# EAGLE schematic Arduino_Rotary_Encoder_LCD (EAGLE 7.6.0)
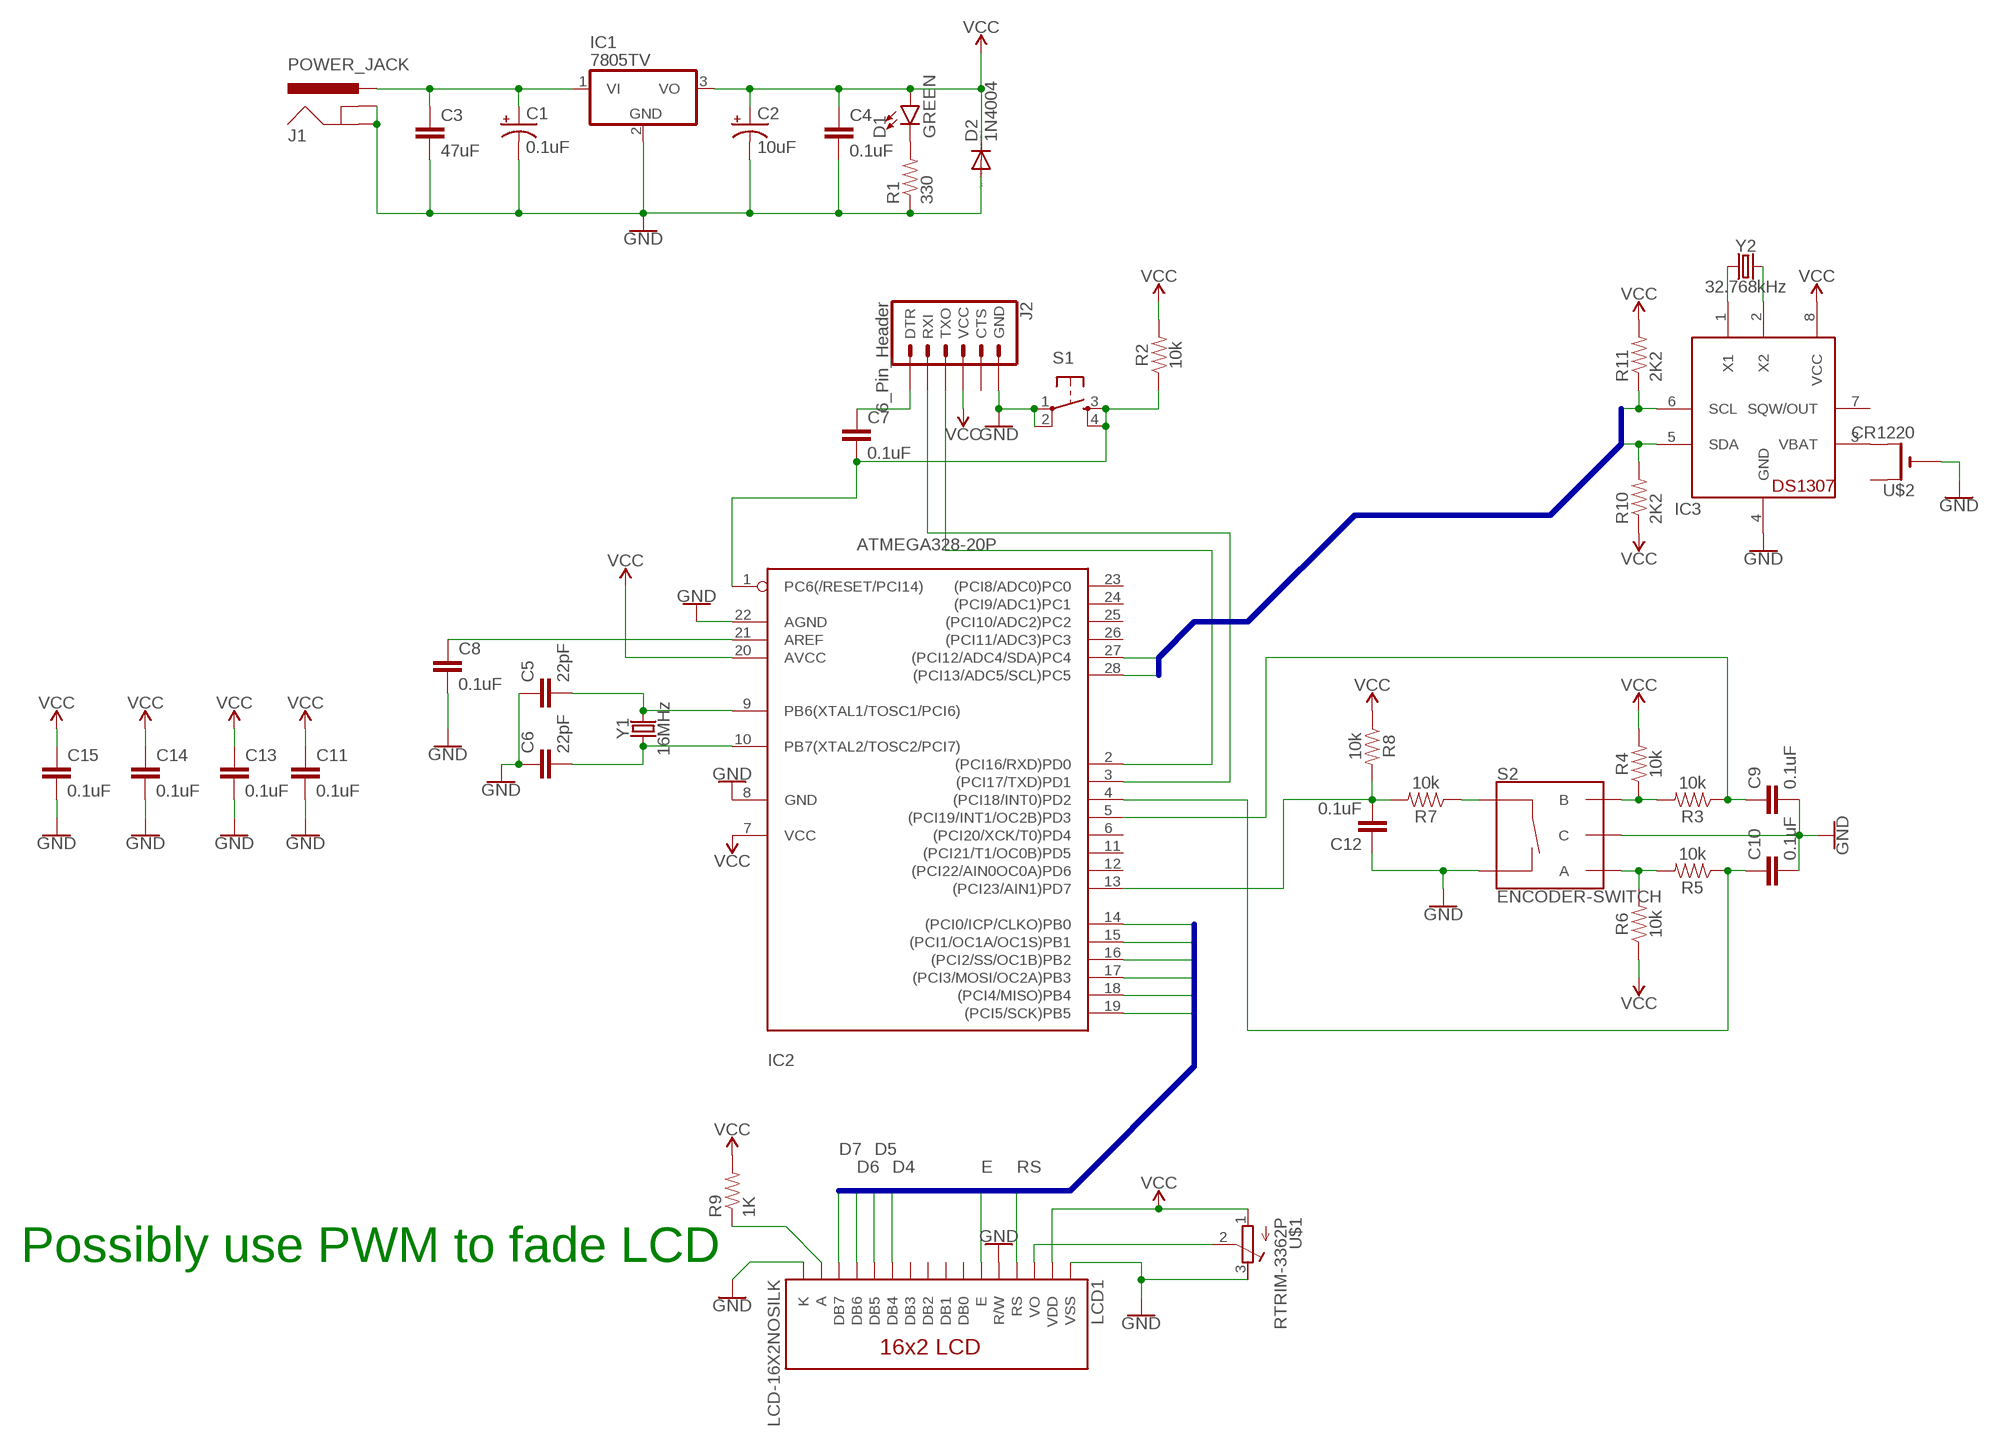
[diagram p0: schematic, sheet 1]

## Parts
C1  0.1uF  CAP_POLPTH2  [CPOL-RADIAL-10UF-25V]
C2  10uF  CAP_POLPTH2  [CPOL-RADIAL-10UF-25V]
C3  47uF  CAPPTH  [CAP-PTH-SMALL]
C4  0.1uF  CAPPTH  [CAP-PTH-SMALL]
C5  22pF  22PF-PTH-2.54MM-200V-5%  [CAP-PTH-2.54]
C6  22pF  22PF-PTH-2.54MM-200V-5%  [CAP-PTH-2.54]
C7  0.1uF  0.1UF-KIT-EZ-50V-20%  [CAP-PTH-SMALL-KIT]
C8  0.1uF  0.1UF-KIT-EZ-50V-20%  [CAP-PTH-SMALL-KIT]
C9  0.1uF  0.1UF-KIT-EZ-50V-20%  [CAP-PTH-SMALL-KIT]
C10  0.1uF  0.1UF-KIT-EZ-50V-20%  [CAP-PTH-SMALL-KIT]
C11  0.1uF  0.1UF-KIT-EZ-50V-20%  [CAP-PTH-SMALL-KIT]
C12  0.1uF  0.1UF-KIT-EZ-50V-20%  [CAP-PTH-SMALL-KIT]
C13  0.1uF  0.1UF-KIT-EZ-50V-20%  [CAP-PTH-SMALL-KIT]
C14  0.1uF  0.1UF-KIT-EZ-50V-20%  [CAP-PTH-SMALL-KIT]
C15  0.1uF  0.1UF-KIT-EZ-50V-20%  [CAP-PTH-SMALL-KIT]
D1  GREEN  LED3MM  [LED_3MM]
D2  1N4004  [DO41-10]
IC1  7805TV  [TO220V]
IC2  ATMEGA328-20P  [DIL28-3]
IC3  DS1307  [DIL08]
J1  POWER_JACK  [POWER_JACK_PTH]
J2  6_Pin_Header  6_PIN_SERIAL_TARGETLONGPADS  [1X06_LONGPADS]
LCD1  LCD-16X2NOSILK  [LCD-16X2_NOSILK]
R1  330  RESISTORKIT  [AXIAL-0.3-KIT]
R2  10k  10KOHM-HORIZ-1/4W-1%  [AXIAL-0.3]
R3  10k  10KOHM-HORIZ-1/4W-1%  [AXIAL-0.3]
R4  10k  10KOHM-HORIZ-1/4W-1%  [AXIAL-0.3]
R5  10k  10KOHM-HORIZ-1/4W-1%  [AXIAL-0.3]
R6  10k  10KOHM-HORIZ-1/4W-1%  [AXIAL-0.3]
R7  10k  10KOHM-HORIZ-1/4W-1%  [AXIAL-0.3]
R8  10k  10KOHM-HORIZ-1/4W-1%  [AXIAL-0.3]
R9  1K  RESISTOREZ  [AXIAL-0.3EZ]
R10  2K2  RESISTORKIT  [AXIAL-0.3-KIT]
R11  2K2  RESISTORKIT  [AXIAL-0.3-KIT]
S1  TAC_SWITCHPTH  [TACTILE-PTH]
S2  ENCODER-SWITCH  [ROTARY_ENC_PLAIN]
U$1  RTRIM-3362P  [RTRIM3362P]
U$2  CR1220  CR1220THM  [CR1220-THM]
Y1  16MHz  CRYSTAL-16MHZPTH-HC49US  [HC49US]
Y2  32.768kHz  CRYSTAL-32.768KHZPTH-2X6  [CRYSTAL-PTH-2X6-CYL]

## Nets
D4: IC2.15((PCI1/OC1A/OC1S)PB1) LCD1.11(DB4)
D5: IC2.16((PCI2/SS/OC1B)PB2) LCD1.12(DB5)
D6: IC2.17((PCI3/MOSI/OC2A)PB3) LCD1.13(DB6)
D7: IC2.18((PCI4/MISO)PB4) LCD1.14(DB7)
E: IC2.19((PCI5/SCK)PB5) LCD1.6(E)
GND: C1.2(-) C2.2(-) C3.2 C4.2 C5.1 C6.1 C8.2 C9.2 C10.2 C11.2 C12.1 C13.2 C14.2 C15.2 D2.A IC1.2(GND) IC2.8(GND) IC2.22(AGND) IC3.4(GND) J1.GND J1.GNDBREAK J2.6(GND) LCD1.1(VSS) LCD1.5(R/W) LCD1.16(K) R1.P$1 S1.1 S1.2 S2.C S2.SW- U$1.3 U$2.-
N$1: C1.1(+) C3.1 IC1.1(VI) J1.PWR
N$2: C5.2 IC2.9(PB6(XTAL1/TOSC1/PCI6)) Y1.2
N$3: C6.2 IC2.10(PB7(XTAL2/TOSC2/PCI7)) Y1.1
N$4: R3.P$2 R4.P$1 S2.B
N$5: C8.1 IC2.21(AREF)
N$6: R5.P$2 R6.P$2 S2.A
N$7: D1.K(C) R1.P$2
N$8: C7.2 IC2.1(PC6(/RESET/PCI14)) R2.P$1 S1.3 S1.4
N$9: C9.1 IC2.5((PCI19/INT1/OC2B)PD3) R3.P$1
N$10: C7.1 J2.1(DTR)
N$11: C10.1 IC2.4((PCI18/INT0)PD2) R5.P$1
N$12: IC2.3((PCI17/TXD)PD1) J2.2(RXI)
N$13: IC2.2((PCI16/RXD)PD0) J2.3(TXO)
N$14: C12.2 IC2.13((PCI23/AIN1)PD7) R7.P$2 R8.P$2
N$15: R7.P$1 S2.SW+
N$16: LCD1.3(VO) U$1.2
N$17: LCD1.15(A) R9.P$1
N$18: IC3.1(X1) Y2.1
N$19: IC3.2(X2) Y2.2
N$20: IC3.3(VBAT) U$2.+2(+1)
RS: IC2.14((PCI0/ICP/CLKO)PB0) LCD1.4(RS)
SCL: IC2.28((PCI13/ADC5/SCL)PC5) IC3.6(SCL) R11.P$1
SDA: IC2.27((PCI12/ADC4/SDA)PC4) IC3.5(SDA) R10.P$2
VCC: C2.1(+) C4.1 C11.1 C13.1 C14.1 C15.1 D1.A D2.C IC1.3(VO) IC2.7(VCC) IC2.20(AVCC) IC3.8(VCC) J2.4(VCC) LCD1.2(VDD) R2.P$2 R4.P$2 R6.P$1 R8.P$1 R9.P$2 R10.P$1 R11.P$2 U$1.1
Unconnected: IC2.6((PCI20/XCK/T0)PD4) IC2.11((PCI21/T1/OC0B)PD5) IC2.12((PCI22/AIN0OC0A)PD6) IC2.23((PCI8/ADC0)PC0) IC2.24((PCI9/ADC1)PC1) IC2.25((PCI10/ADC2)PC2) IC2.26((PCI11/ADC3)PC3) IC3.7(SQW/OUT) J2.5(CTS) LCD1.7(DB0) LCD1.8(DB1) LCD1.9(DB2) LCD1.10(DB3) U$2.+1(+)

## Buses
RS,E,D4,D5,D6,D7
SDA,SCL

## Notes on the sheet
- Possibly use PWM to fade LCD

## Library data of the parts
C1 C2 = SparkFun-Passives:CAP_POL: Capacitor Polarized These are standard SMD and PTH capacitors. Normally 10uF, 47uF, and 100uF in electrolytic and tantalum varieties. Always verify the external diameter of the through hole cap, it varies with capacity, voltage, and manufacturer. The EIA devices should be standard.
C3 C4 = SparkFun-Passives:CAP: Capacitor Standard 0603 ceramic capacitor, and 0.1" leaded capacitor.
C5 C6 = SparkFun-Capacitors:22PF: 22pF ceramic capacitors A capacitor is a passive two-terminal electrical component used to store electrical energy temporarily in an electric field.; PROD_ID: CAP-09128
C7-C15 = SparkFun-Capacitors:0.1UF: 0.1µF ceramic capacitors A capacitor is a passive two-terminal electrical component used to store electrical energy temporarily in an electric field.; PROD_ID: CAP-08370
D1 = SparkFun-LED:LED: LED (Generic) Standard schematic elements and footprints for 5mm, 3mm, 1206, and 0603 sized LEDs. Generic LEDs with no color specified.; PROD_ID: DIO-08794
D2 = diode:1N4004: DIODE general purpose rectifier, 1 A
IC1 = linear:78*: Positive VOLTAGE REGULATOR Source: http://cache.national.com/ds/LM/LM78L05.pdf http://www.fairchildsemi.com/ds/LM/LM7805.pdf
IC2 = atmega328:ATMEGA328*P: MICROCONTROLLER 32 kBytes FLASH 2 kBytes SRAM 1 kBytes EEPROM USART 8-channel 10 bit ADC
IC3 = adafruit:DS1307: DS1307 Real time clock (RTC) with battery backup ability. Talk to it via i2c
J1 = SparkFun-Connectors:POWER_JACK: Power Jack Connector This is the standard 5.5mm barrel jack for power. The PTH is the most common, proven, reliable, footprint. The Slot footprint only works if the mill layer is transmitted to the PCB fab house so be warned. Here are the connectors we sell at SparkFun: DC Barrel Power Jack/Connector <https://www.sparkfun.com/products/119> (PRT-00119) DC Barrel Power Jack/Connector (SMD) <https://www.sparkfun.com/products/12748> (PRT-12748) DC Barrel Jack Adapter - Breadboard Compatible <https://www.sparkfun.com/products/10811> (PRT-10811) It is used on this SparkFun product (and many, many others): SparkFun RedBoard - Programmed with Arduino <https://www.sparkfun.com/products/12757> (DEV-12757) Also, if you need a mating power supply or connector, please check these out: Wall Adapter Power Supply - 9VDC 650mA <https://www.sparkfun.com/products/298> (TOL-00298) DC Barrel Jack Adapter - Male <https://www.sparkfun.com/products/10287> (PRT-10287); PROD_ID: CONN-08197
J2 = SparkFun-Connectors:6_PIN_SERIAL_TARGET: 6-pin header connection for use with the "FTDI BASIC" pinout - TARGET SIDE. Also known as "Arduino Serial Program Header". It is used to mate with our FTDI Basic serial programmers using the Arduino IDE. Note, this device has "TARGET" in the name. It is intended to be used on a design that contains a target micro-controller that you wish to program. The "sister" device, named "CABLE" is inteneded to be used on a design that usually lives on the end of your USB cable and prvides the converter chip (FTDI232 or FTDI231x) to commnicate serial RX/TX. You can populate with some of these: Break Away Headers - Straight <https://www.sparkfun.com/products/116> (PRT-00116) For reference (or to suit your programming needs) check out these designs: SparkFun FTDI Basic Breakout - 5V <https://www.sparkfun.com/products/9716> (DEV-09716) SparkFun FTDI Basic Breakout - 3.3V <https://www.sparkfun.com/products/9873> (DEV-09873) SparkFun FTDI SmartBasic <https://www.sparkfun.com/products/12935> (DEV-12935) SparkFun Beefy 3 - FTDI Basic Breakout <https://www.sparkfun.com/products/13746> (DEV-13746)
LCD1 = SparkFun-Displays:LCD-16X2: Standard text-only 16x2 parallel input LCD Basic 16 character by 2 line display. Typically utilizes the extremely common HD44780 parallel interface chipset SparkFun Products: Basic 16x2 Green <https://www.sparkfun.com/products/255> Basic 8x2 Green <https://www.sparkfun.com/products/11122>; SF_ID: LCD-00255
R1 R9-R11 = SparkFun-Passives:RESISTOR: Resistor Basic schematic elements and footprints for 0603, 1206, and PTH resistors.
R2-R8 = SparkFun-Resistors:10KOHM: 10kΩ resistor A resistor is a passive two-terminal electrical component that implements electrical resistance as a circuit element. Resistors act to reduce current flow, and, at the same time, act to lower voltage levels within circuits. - Wikipedia; PROD_ID: RES-12183
S1 = SparkFun-Retired:TAC_SWITCH: Momentary Switch Button commonly used for reset or general input. Spark Fun Electronics SKU : COM-00097 SMT- SWCH-08247
S2 = SparkFun-Switches:ENCODER-SWITCH: Rotary Encoder w/ Select Switch Encoders rotate similarly to potentiometers, but they’re different from potentiometers in that an encoder has full rotation without limits. They output gray code so that you can tell how much and in which direction the encoder has been turned. This encoder includes a push-down select switch built into the shaft. SparkFun Products Rotary Encoder <https://www.sparkfun.com/products/9117> (COM-09117); SF_SKU: COM-09117
U$1 = GeekAmmo:RTRIM: BOURNS 3362 - 1/4" Square Trimpot® Trimming Potentiometer
U$2 = adafruit:CR1220: CR1216/CR1220/CR1225 12mm 3V lithium coin cell Great for battery packup. Both SMT and THM holders. Note the THM package has the ground pads on both sides of the PCB so that the masks are the same - this reduces the cost
Y1 = SparkFun-Clocks:CRYSTAL-16MHZ: 16MHz Crystal Digikey Example <http://www.digikey.com/product-search/en?keywords=535-9122-1-ND> Frequency: 16MHz Frequency Stability: ±50ppm Frequency Tolerance: ±20ppm Load Capacitance: 18pF SparkFun Products: Pro Micro -5V/16MHz <https://www.sparkfun.com/products/12640> SparkFun Serial Enabled LCD Kit <https://www.sparkfun.com/products/10097>; PROD_ID: XTAL-08181; SF_ID: COM-00536
Y2 = SparkFun-Clocks:CRYSTAL-32.768KHZ: 32.768kHz Crystal Frequency: 32.768kHz Frequency Stability: ±20ppm Load Capacitance: 12.5pF (PTH-2X6 & SMD-3.2X1.5), 6pF (SMD-2X6) SparkFun Products: SparkFun BigTime Watch Kit <https://www.sparkfun.com/products/11734> SparkFun nRF52832 Breakout <https://www.sparkfun.com/products/13990> SparkFun Real Time Clock Module <https://www.sparkfun.com/products/12708>; PROD_ID: XTAL-10112